# EAGLE schematic Brine_SCH_v67 (EAGLE 9.7.0)
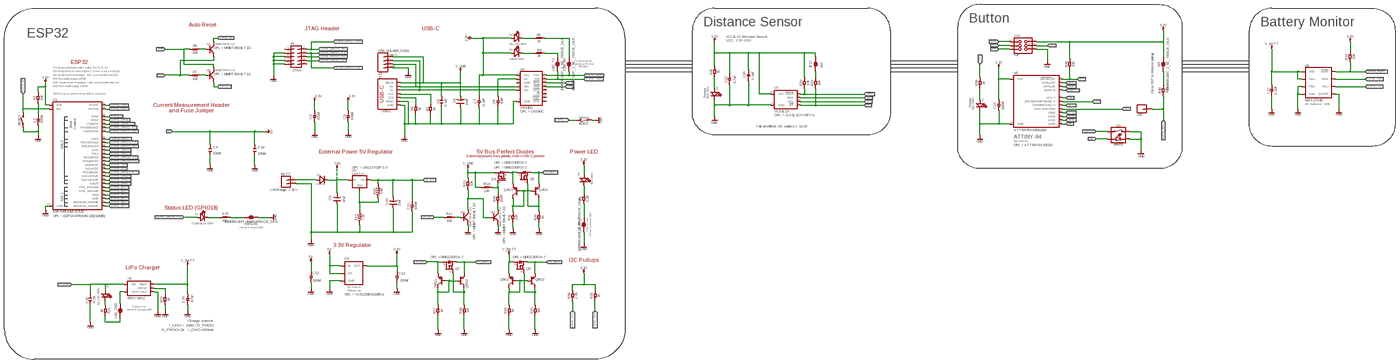
[diagram p0: schematic, sheet 1, overview]
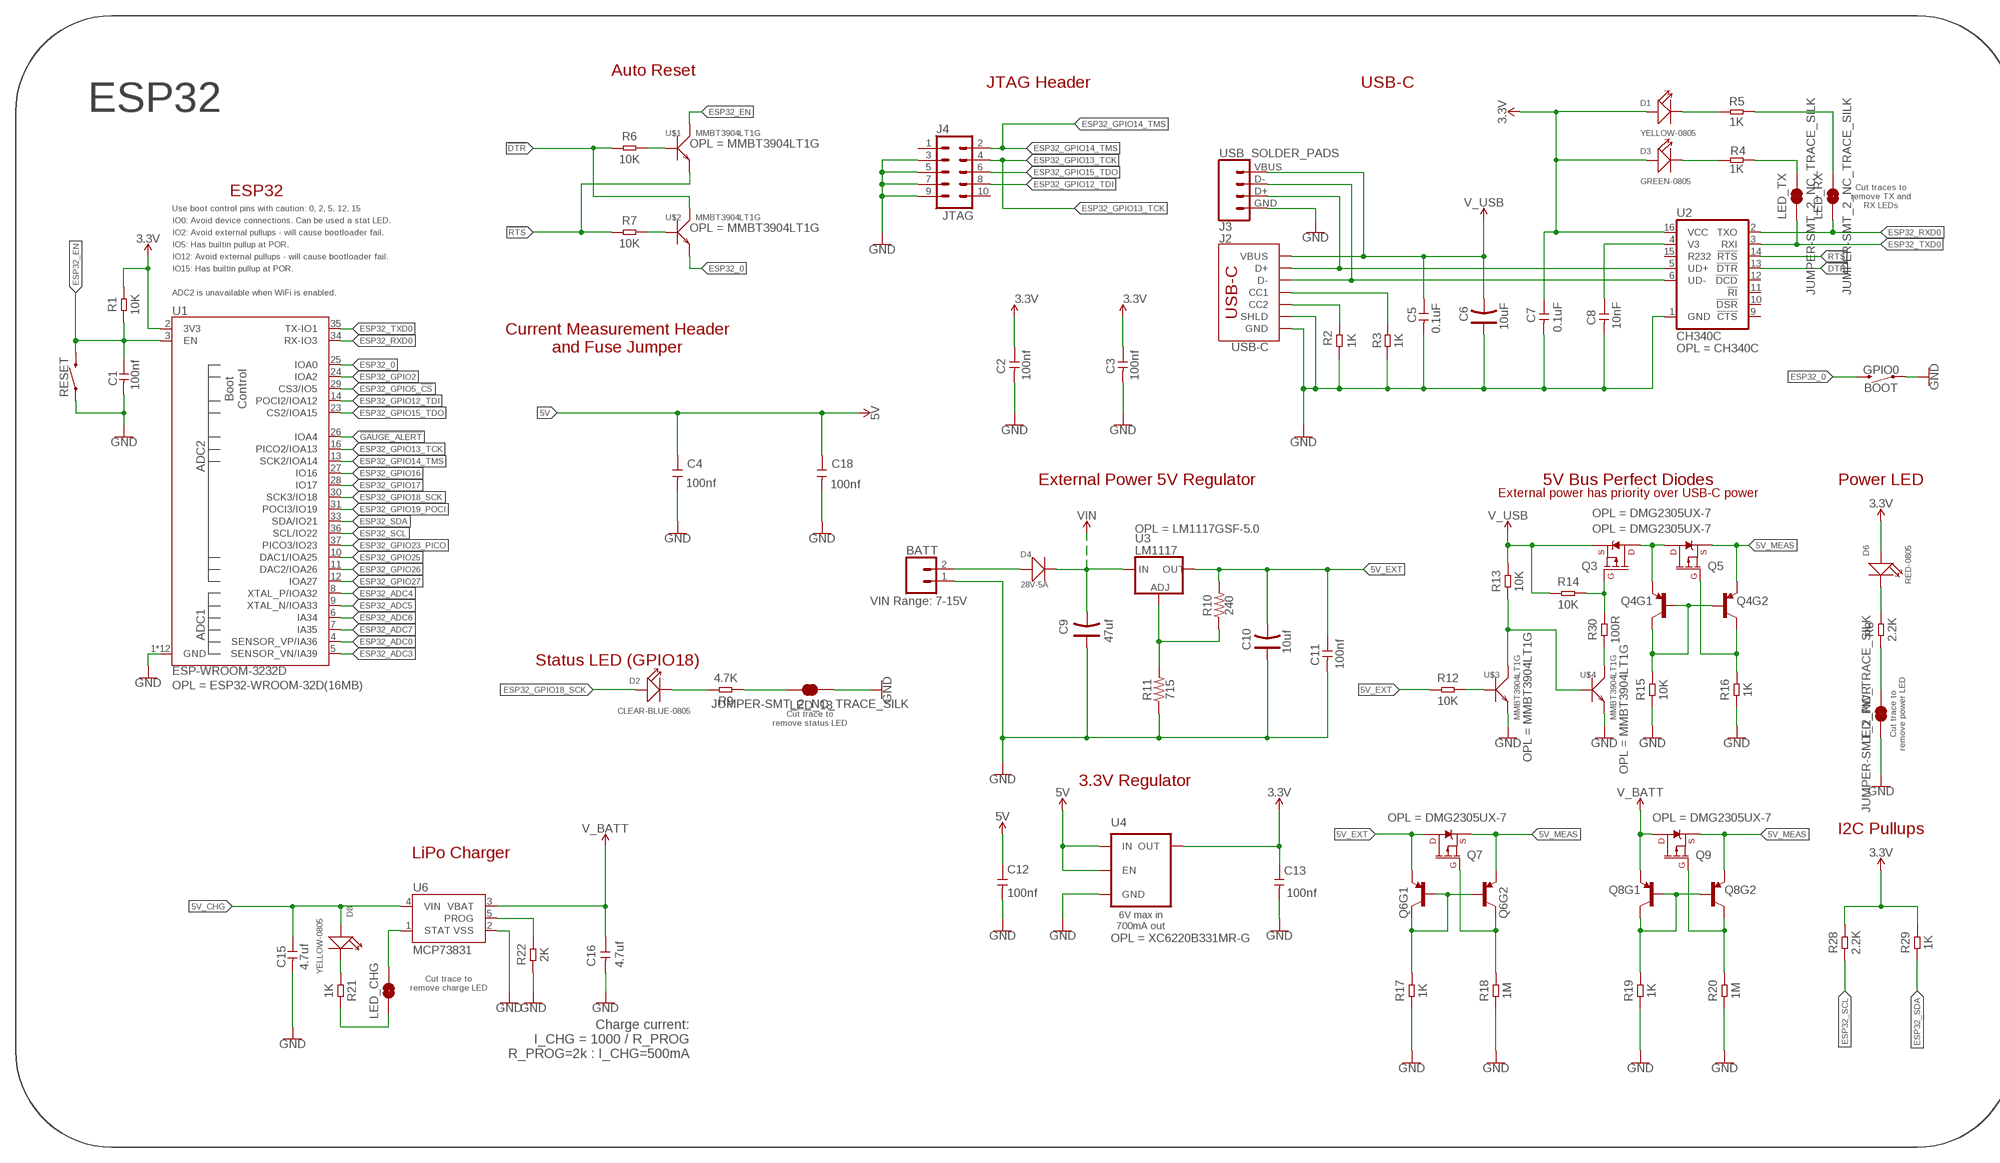
[diagram p1: schematic, sheet 1, part 1 of 4]
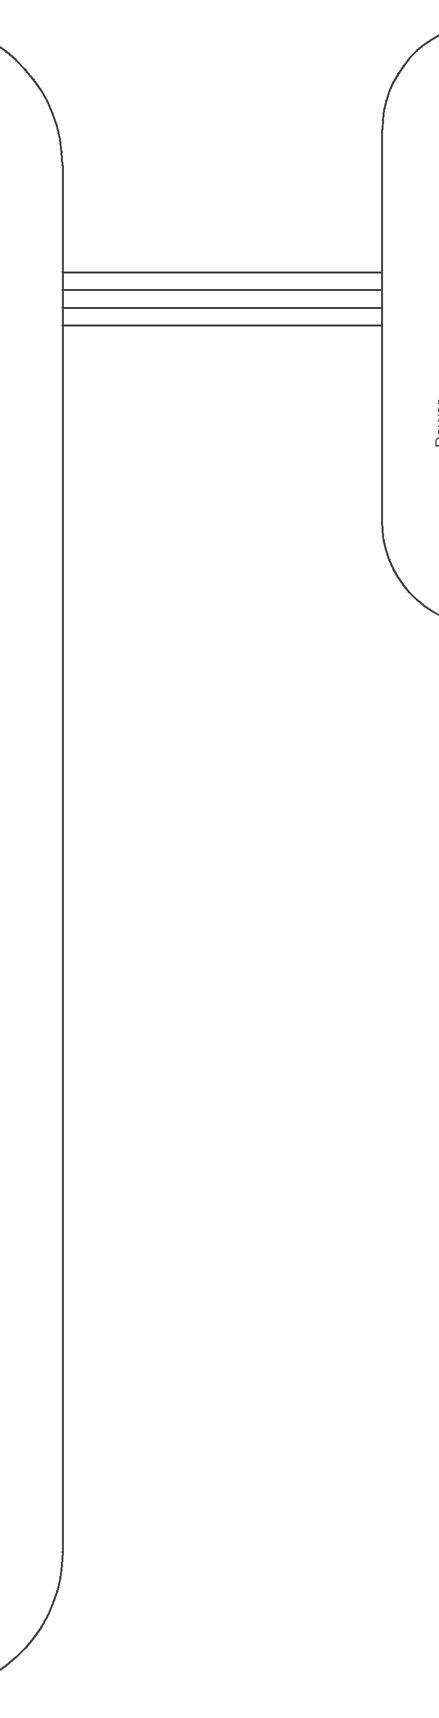
[diagram p2: schematic, sheet 1, part 2 of 4]
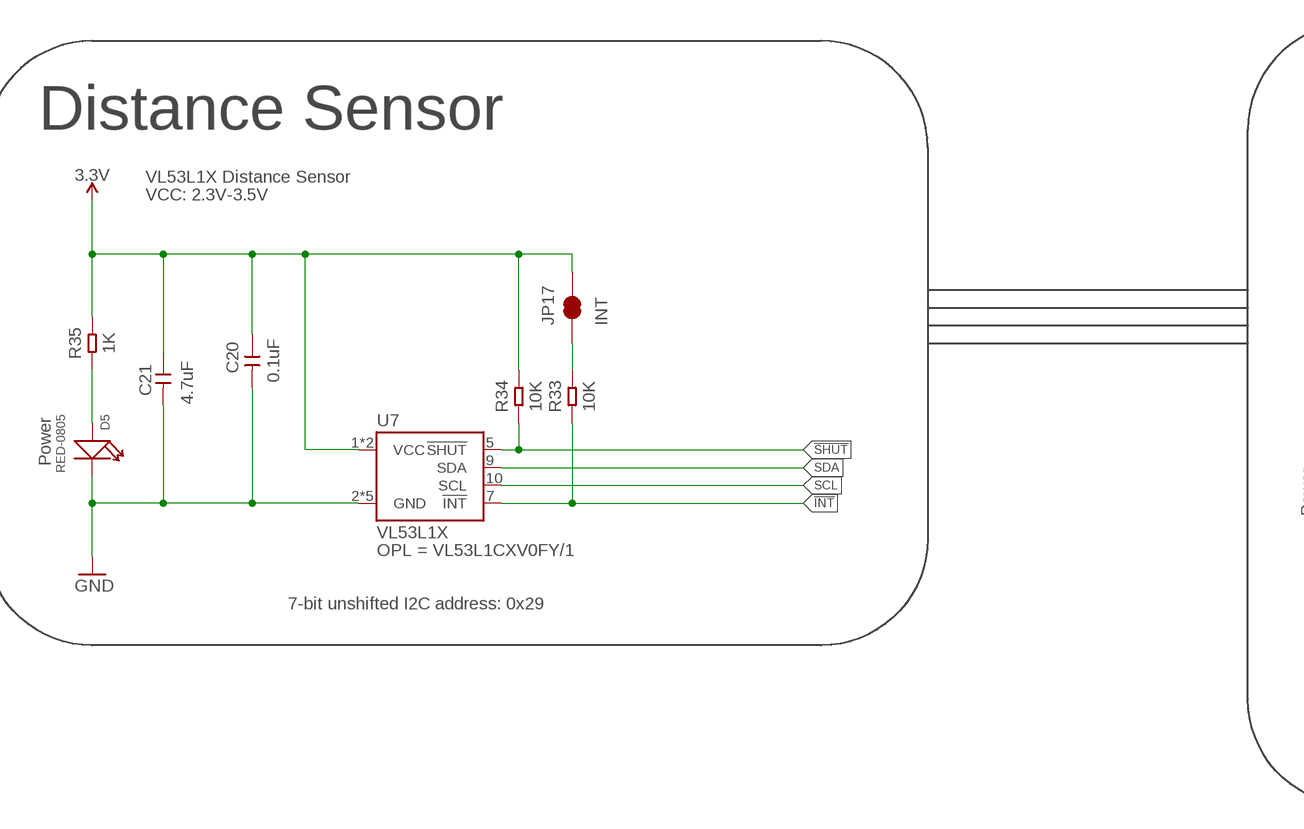
[diagram p3: schematic, sheet 1, part 3 of 4]
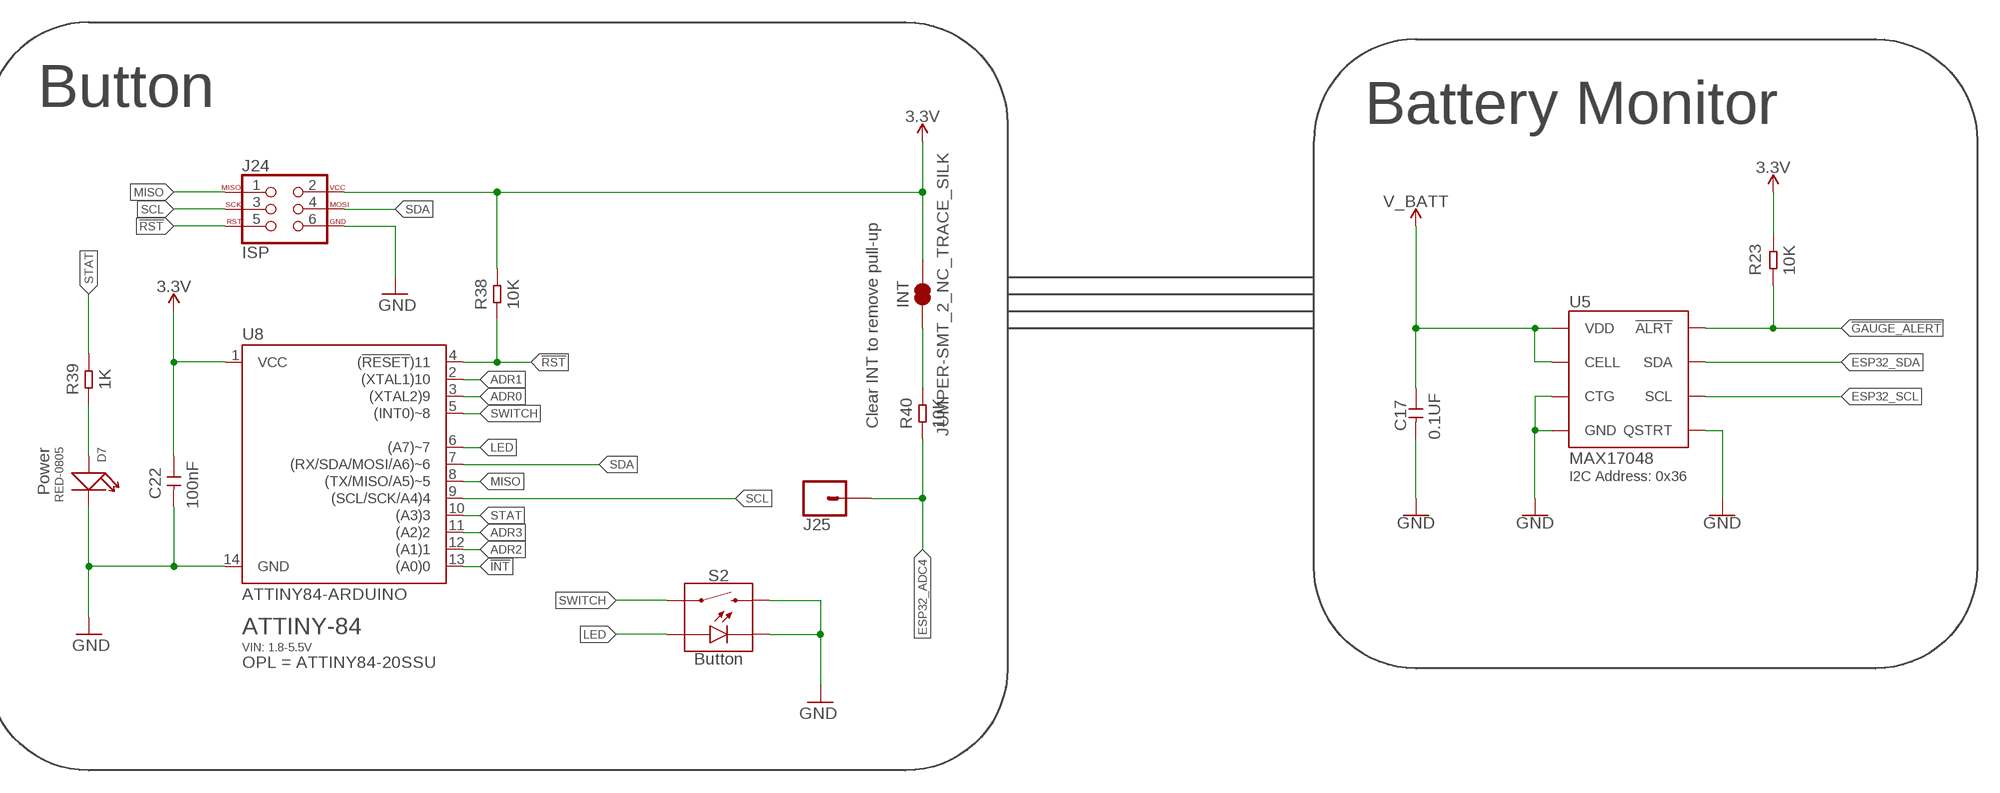
[diagram p4: schematic, sheet 1, part 4 of 4]

## Parts
BATT  CONN_02  [1X02]
BOOT  GPIO0  MOMENTARY-SWITCH-SPST-SMD-5.2-TALL-REDUNDANT  [TACTILE_SWITCH_SMD_5.2MM]
C1  100nf  CERAMIC-100NF-50V-10%-X7R(0805)  [C0805]
C2  100nf  CERAMIC-100NF-50V-10%-X7R(0805)  [C0805]
C3  100nf  CERAMIC-100NF-50V-10%-X7R(0805)  [C0805]
C4  100nf  CERAMIC-100NF-50V-10%-X7R(0805)  [C0805]
C5  0.1uF  CERAMIC-100NF-50V-10%-X7R(0805)  [C0805]
C6  10uF  TANTALUM-SMD-10UF-10V-10%(AVX-A)  [AVX-A]
C7  0.1uF  CERAMIC-100NF-50V-10%-X7R(0805)  [C0805]
C8  10nF  CERAMIC-10NF-50V-5%-X7R(0805)  [C0805]
C9  47uf  TANTALUM-SMD-47UF-6.3V(AVX-A)  [AVX-A]
C10  10uf  TANTALUM-SMD-10UF-16V-10%(AVX-A)  [AVX-A]
C11  100nf  CERAMIC-100NF-50V-10%-X7R(0805)  [C0805]
C12  100nf  CERAMIC-100NF-50V-10%-X7R(0805)  [C0805]
C13  100nf  CERAMIC-100NF-50V-10%-X7R(0805)  [C0805]
C15  4.7uf  CERAMIC-4.7UF-25V-10%-X5R(0805)  [C0805]
C16  4.7uf  CERAMIC-4.7UF-25V-10%-X5R(0805)  [C0805]
C17  0.1UF  CERAMIC-100NF-50V-10%-X7R(0805)  [C0805]
C18  100nf  CERAMIC-100NF-50V-10%-X7R(0805)  [C0805]
C20  0.1uF  CERAMIC-100NF-50V-10%-X7R(0805)  [C0805]
C21  4.7uF  CERAMIC-4.7UF-25V-10%-X5R(0805)  [C0805]
C22  100nF  CERAMIC-100NF-50V-10%-X7R(0805)  [C0805]
D1  YELLOW-0805  SMD-LED-CLEAR-YELLOW(0805)  [LED-0805]
D2  CLEAR-BLUE-0805  SMD-LED-CLEAR-BLUE(0805)  [LED-0805]
D3  GREEN-0805  SMD-LED-CLEAR-GREEN(0805)  [LED-0805]
D4  28V-5A  SMD-DIODE-SCHOTTKY-28V-5A(DO-214AA)  [DO-214AA]
D5  RED-0805  SMD-LED-CLEAR-RED(0805)  [LED-0805]
D6  RED-0805  SMD-LED-CLEAR-RED(0805)  [LED-0805]
D7  RED-0805  SMD-LED-CLEAR-RED(0805)  [LED-0805]
D8  YELLOW-0805  SMD-LED-CLEAR-YELLOW(0805)  [LED-0805]
INT  JUMPER-SMT_2_NC_TRACE_SILK  [SMT-JUMPER_2_NC_TRACE_SILK]
J2  USB-C  USB_C_4-LAYER-ISOLATED  [USB-C-16P-4LAYER-ISOLATED]
J3  USB_SOLDER_PADS  [USB-SOLDER-PADS]
J4  CONN_05X20.05_IN_PTH_SILK  [2X5_PTH_SILK_.05]
J24  ISP  AVR_SPI_PROG_3X2TESTPOINTS  [2X3_TEST_POINTS]
J25  CONN_01PTH_NO_SILK_YES_STOP  [1X01_NO_SILK]
JP17  INT  JUMPER-PAD-2-NC_BY_TRACE  [PAD-JUMPER-2-NC_BY_TRACE_YES_SILK]
LED_18  JUMPER-SMT_2_NC_TRACE_SILK  [SMT-JUMPER_2_NC_TRACE_SILK]
LED_CHG  JUMPER-SMT_2_NC_TRACE_SILK  [SMT-JUMPER_2_NC_TRACE_SILK]
LED_PWR  JUMPER-SMT_2_NC_TRACE_SILK  [SMT-JUMPER_2_NC_TRACE_SILK]
LED_RX  JUMPER-SMT_2_NC_TRACE_SILK  [SMT-JUMPER_2_NC_TRACE_SILK]
LED_TX  JUMPER-SMT_2_NC_TRACE_SILK  [SMT-JUMPER_2_NC_TRACE_SILK]
Q3  20V/4.2A/52mΩ/1.4W  MOSFET_PCH-DMG2305UX-7  [SOT23-3]
Q4  TRANS_PNP_DUALSOT-363  [SOT363_PHILIPS]
Q5  20V/4.2A/52mΩ/1.4W  MOSFET_PCH-DMG2305UX-7  [SOT23-3]
Q6  TRANS_PNP_DUALSOT-363  [SOT363_PHILIPS]
Q7  20V/4.2A/52mΩ/1.4W  MOSFET_PCH-DMG2305UX-7  [SOT23-3]
Q8  TRANS_PNP_DUALSOT-363  [SOT363_PHILIPS]
Q9  20V/4.2A/52mΩ/1.4W  MOSFET_PCH-DMG2305UX-7  [SOT23-3]
R1  10K  SMD-RES-10K-1%-1/8W(0805)  [R0805]
R2  1K  SMD-RES-5.1K-1%-1/8W(0805)  [R0805]
R3  1K  SMD-RES-5.1K-1%-1/8W(0805)  [R0805]
R4  1K  SMD-RES-1K-5%-1/8W(0805)  [R0805]
R5  1K  SMD-RES-1K-5%-1/8W(0805)  [R0805]
R6  10K  SMD-RES-10K-1%-1/8W(0805)  [R0805]
R7  10K  SMD-RES-10K-1%-1/8W(0805)  [R0805]
R8  2.2K  SMD-RES-2.2K-5%-1/8W(0805)  [R0805]
R9  4.7K  SMD-RES-4.7K-5%-1/8W(0805)  [R0805]
R10  240  R-US_CHIP-0805(2012-METRIC)  [RESC2012X65]
R11  715  R-US_CHIP-0805(2012-METRIC)  [RESC2012X65]
R12  10K  SMD-RES-10K-1%-1/8W(0805)  [R0805]
R13  10K  SMD-RES-10K-1%-1/8W(0805)  [R0805]
R14  10K  SMD-RES-10K-1%-1/8W(0805)  [R0805]
R15  10K  SMD-RES-10K-1%-1/8W(0805)  [R0805]
R16  1K  SMD-RES-4.7K-1%-1/8W(0805)  [R0805]
R17  1K  SMD-RES-100K-1%-1/8W(0805)  [R0805]
R18  1M  SMD-RES-1M-1%-1/10W(0603)  [R0603]
R19  1K  SMD-RES-100K-1%-1/8W(0805)  [R0805]
R20  1M  SMD-RES-1M-1%-1/10W(0603)  [R0603]
R21  1K  SMD-RES-1K-1%-1/8W(0805)  [R0805]
R22  2K  SMD-RES-2K-1%-1/8W(0805)  [R0805]
R23  10K  SMD-RES-10K-1%-1/8W(0805)  [R0805]
R28  2.2K  SMD-RES-2.2K-5%-1/8W(0805)  [R0805]
R29  1K  SMD-RES-2.2K-1%-1/8W(0805)  [R0805]
R30  100R  SMD-RES-100R-5%-1/8W(0805)  [R0805]
R33  10K  SMD-RES-10K-1%-1/8W(0805)  [R0805]
R34  10K  SMD-RES-10K-1%-1/8W(0805)  [R0805]
R35  1K  SMD-RES-1K-5%-1/8W(0805)  [R0805]
R38  10K  SMD-RES-10K-1%-1/8W(0805)  [R0805]
R39  1K  SMD-RES-1K-5%-1/8W(0805)  [R0805]
R40  10K  SMD-RES-10K-1%-1/8W(0805)  [R0805]
RESET  Reset  MOMENTARY-SWITCH-SPST-SMD-5.2-TALL-REDUNDANT  [TACTILE_SWITCH_SMD_5.2MM]
S2  Button  MOMENTARY-SWITCH-SPST-LED-PTH-12MM  [TACTILE_SWITCH_LED_PTH_12MM]
U1  ESP-WROOM-3232D  [ESP-WROOM-32D]
U2  CH340C  [SO016]
U3  LM1117  V_REG_LM1117SOT223  [SOT223]
U4  XC6222B331MR-G  [SOT23-5]
U5  MAX17048  MAX17048DFN8  [DFN-8]
U6  MCP73831  [SOT23-5]
U7  VL53L1X  VL53L1XSMD  [VL53L1X]
U8  ATTINY84-ARDUINO  [SO14]
U$1  MMBT3904LT1G  SMD-TRANSISTORS-NPN-40V-200MA-MMBT3904LT1G(SOT-23)  [SOT-23]
U$2  MMBT3904LT1G  SMD-TRANSISTORS-NPN-40V-200MA-MMBT3904LT1G(SOT-23)  [SOT-23]
U$3  MMBT3904LT1G  SMD-TRANSISTORS-NPN-40V-200MA-MMBT3904LT1G(SOT-23)  [SOT-23]
U$4  MMBT3904LT1G  SMD-TRANSISTORS-NPN-40V-200MA-MMBT3904LT1G(SOT-23)  [SOT-23]

## Nets
3.3V: C2.1 C3.1 C7.1 C13.1 C20.1 C21.1 C22.1 D1.+ D3.+ D6.+ INT.2 J24.2 JP17.2 R1.2 R23.2 R28.2 R29.2 R34.2 R35.2 R38.2 U1.2(3V3) U2.16(VCC) U4.5(OUT) U7.1(VCC) U7.11(VCC) U8.1(VCC)
5V [power]: C4.1 C12.1 C18.1 U4.1(IN) U4.3(EN)
5V_CHG: C15.1 D8.+ U6.4(VIN)
5V_EXT [power]: C10.- C11.1 Q6.1(E) Q7.3(D) R10.2 R12.1 U3.2(OUT) U3.4(OUT)
5V_MEAS: Q4.4(E) Q5.2(S) Q6.4(E) Q7.2(S) Q8.4(E) Q9.2(S)
!DTR!: R6.1 U2.13(!DTR) U$2.3(C)
!GAUGE_ALERT: U1.26(IOA4)
!GAUGE_ALERT!: R23.1 U5.5(!ALRT)
!INT: R33.1 U7.7(!INT) U8.13((A0)0)
!RST: J24.5 R38.1 U8.4((!RESET!)11)
!RTS!: R7.1 U2.14(!RTS) U$1.2(E)
!SHUT: R34.1 U7.5(!SHUT)
ADR0: U8.3((XTAL2)9)
ADR1: U8.2((XTAL1)10)
ADR2: U8.12((A1)1)
ADR3: U8.11((A2)2)
CC1: J2.A5(CC1) R3.2
CC2: J2.B5(CC2) R2.2
D+: J2.A6(D+) J2.B6(D+) J3.D+ U2.5(UD+)
D-: J2.A7(D-) J2.B7(D-) J3.D- U2.6(UD-)
ESP32_0: BOOT.3 BOOT.4 U1.25(IOA0) U$2.2(E)
ESP32_ADC0: U1.4(SENSOR_VP/IA36)
ESP32_ADC3: U1.5(SENSOR_VN/IA39)
ESP32_ADC4: J25.1 R40.1 U1.8(XTAL_P/IOA32)
ESP32_ADC5: U1.9(XTAL_N/IOA33)
ESP32_ADC6: U1.6(IA34)
ESP32_ADC7: U1.7(IA35)
ESP32_EN: C1.1 R1.1 RESET.3 RESET.4 U1.3(EN) U$1.3(C)
ESP32_GPIO2: U1.24(IOA2)
ESP32_GPIO5_!CS!: U1.29(CS3/IO5)
ESP32_GPIO12_TDI: J4.8 U1.14(POCI2/IOA12)
ESP32_GPIO13_TCK: J4.4 U1.16(PICO2/IOA13)
ESP32_GPIO14_TMS: J4.2 U1.13(SCK2/IOA14)
ESP32_GPIO15_TDO: J4.6 U1.23(CS2/IOA15)
ESP32_GPIO16: U1.27(IO16)
ESP32_GPIO17: U1.28(IO17)
ESP32_GPIO18_SCK: D2.+ U1.30(SCK3/IO18)
ESP32_GPIO19_POCI: U1.31(POCI3/IO19)
ESP32_GPIO23_PICO: U1.37(PICO3/IO23)
ESP32_GPIO25: U1.10(DAC1/IOA25)
ESP32_GPIO26: U1.11(DAC2/IOA26)
ESP32_GPIO27: U1.12(IOA27)
ESP32_RXD0: LED_RX.1 U1.34(RX-IO3) U2.2(TXO)
ESP32_SCL: R28.1 U1.36(SCL/IO22) U5.7(SCL)
ESP32_SDA: R29.1 U1.33(SDA/IO21) U5.8(SDA)
ESP32_TXD0: LED_TX.1 U1.35(TX-IO1) U2.3(RXI)
GND: BATT.1 BOOT.1 BOOT.2 C1.2 C2.2 C3.2 C4.2 C5.2 C6.+ C7.2 C8.2 C9.+ C10.+ C11.2 C12.2 C13.2 C15.2 C16.2 C17.2 C18.2 C20.2 C21.2 C22.2 D5.- D7.- J2.GND J2.GND2(GND) J2.SHLD1(SHLD) J2.SHLD2(SHLD) J2.SHLD3(SHLD) J2.SHLD4(SHLD) J2.SHLD5(SHLD) J2.SHLD6(SHLD) J2.SHLD7(SHLD) J2.SHLD8(SHLD) J3.GND J4.3 J4.5 J4.7 J4.9 J24.6 LED_18.2 LED_PWR.2 R2.1 R3.1 R11.1 R15.1 R16.1 R17.1 R18.1 R19.1 R20.1 R22.1 RESET.1 RESET.2 S2.2 S2.C U1.1(GND) U1.15(GND) U1.38(GND) U1.GND U1.GNDT1(GND) U1.GNDT2(GND) U1.GNDT3(GND) U1.GNDT4(GND) U1.GNDT5(GND) U1.GNDT6(GND) U1.GNDT7(GND) U1.GNDT8(GND) U2.1(GND) U4.2(GND) U5.1(CTG) U5.4(GND) U5.6(QSTRT) U5.9(GND) U6.2(VSS) U7.2(GND) U7.3(GND) U7.4(GND) U7.6(GND) U7.12(GND) U8.14(GND) U$3.2(E) U$4.2(E)
INT_R: INT.1 R40.2
LED: S2.A U8.6((A7)~7)
MISO: J24.1 U8.8((TX/MISO/A5)~5)
N$1: BATT.2 D4.+
N$2: D6.- R8.2
N$3: D2.- R9.2
N$4: LED_18.1 R9.1
N$5: D3.- R4.2
N$6: C8.1 U2.4(V3)
N$7: D1.- R5.2
N$8: Q6.2(B) Q6.5(B) Q6.6(C) R17.2
N$9: Q3.1(G) R14.2 R30.2
N$10: Q6.3(C) Q7.1(G) R18.2
N$11: R30.1 U$4.3(C)
N$12: Q4.2(B) Q4.5(B) Q4.6(C) R15.2
N$13: Q8.2(B) Q8.5(B) Q8.6(C) R19.2
N$14: LED_PWR.1 R8.1
N$15: R10.1 R11.2 U3.1(ADJ)
N$16: Q4.3(C) Q5.1(G) R16.2
N$17: Q8.3(C) Q9.1(G) R20.2
N$18: R6.2 U$1.1(B)
N$19: R12.2 U$3.1(B)
N$20: R7.2 U$2.1(B)
N$21: R22.2 U6.5(PROG)
N$22: R13.1 U$3.3(C) U$4.1(B)
N$23: D5.+ R35.1
N$24: LED_CHG.2 U6.1(STAT)
N$25: LED_CHG.1 R21.2
N$26: D8.- R21.1
N$30: LED_TX.2 R4.1
N$31: LED_RX.2 R5.1
N$38: JP17.1 R33.2
N$40: D7.+ R39.1
SCL: J24.3 U7.10(SCL) U8.9((SCL/SCK/A4)4)
SDA: J24.4 U7.9(SDA) U8.7((RX/SDA/MOSI/A6)~6)
STAT: R39.2 U8.10((A3)3)
SWITCH: S2.4 U8.5((INT0)~8)
V_BATT: C16.1 C17.1 Q8.1(E) Q9.3(D) U5.2(CELL) U5.3(VDD) U6.3(VBAT)
V_USB: C5.1 C6.- J2.VBUS1(VBUS) J2.VBUS2(VBUS) J3.VBUS Q3.2(S) R13.2 R14.1
VIN [power]: C9.- D4.- U3.3(IN)
VUSB_PROT: Q3.3(D) Q4.1(E) Q5.3(D)
Unconnected: J4.1 J4.10 U2.9(!CTS) U2.10(!DSR) U2.11(!RI) U2.12(!DCD) U2.15(R232)

## Notes on the sheet
- Button
- Auto Reset | Distance Sensor | Battery Monitor
- JTAG Header | USB-C
- ESP32 | VL53L1X Distance Sensor
- VCC: 2.3V-3.5V
- ESP32
- Use boot control pins with caution: 0, 2, 5, 12, 15
- Cut traces to
  remove TX and
  RX LEDs
- IO0: Avoid device connections. Can be used a stat LED. | JTAG
- IO2: Avoid external pullups - will cause bootloader fail.
- IO5: Has builtin pullup at POR.
- IO12: Avoid external pullups - will cause bootloader fail.
- IO15: Has builtin pullup at POR.
- ADC2 is unavailable when WiFi is enabled. | Clear INT to remove pull-up
- Power | Power
- I2C Address: 0x36
- Current Measurement Header
  and Fuse Jumper
- 7-bit unshifted I2C address: 0x29
- ATTINY-84
- VIN: 1.8-5.5V
- Power LED
- External Power 5V Regulator | 5V Bus Perfect Diodes
- External power has priority over USB-C power
- VIN Range: 7-15V
- Status LED (GPIO18)
- Cut trace to
  remove power LED
- Cut trace to
  remove status LED
- 3.3V Regulator
- I2C Pullups
- LiPo Charger
- 6V max in
  700mA out
- Cut trace to
  remove charge LED
- Charge current:
  I_CHG = 1000 / R_PROG
  R_PROG=2k : I_CHG=500mA

## Library data of the parts
BATT = SparkFun-Connectors:CONN_02: Multi connection point. Often used as Generic Header-pin footprint for 0.1 inch spaced/style header connections On any of the 0.1 inch spaced packages, you can populate with these: Break Away Headers - Straight <https://www.sparkfun.com/products/116> (PRT-00116) Break Away Male Headers - Right Angle <https://www.sparkfun.com/products/553> (PRT-00553) Female Headers <https://www.sparkfun.com/products/115> (PRT-00115) Break Away Headers - Machine Pin <https://www.sparkfun.com/products/117> (PRT-00117) Break Away Female Headers - Swiss Machine Pin <https://www.sparkfun.com/products/743> (PRT-00743) For SCREWTERMINALS and SPRING TERMINALS visit here: Screw Terimnals on SparkFun.com <https://www.sparkfun.com/search/results?term=Screw+Terminals> (5mm/3.5mm/2.54mm spacing) This device is also useful as a general connection point to wire up your design to another part of your project. Our various solder wires solder well into these plated through hole pads. Hook-Up Wire - Assortment (Stranded, 22 AWG) <https://www.sparkfun.com/products/11375> (PRT-11375) Hook-Up Wire - Assortment (Solid Core, 22 AWG) <https://www.sparkfun.com/products/11367> (PRT-11367) View the entire wire category on our website here <https://www.sparkfun.com/categories/141> Special notes: Molex polarized connector foot print use with: PRT-08233 with associated crimp pins and housings. 2.54_SCREWTERM for use with PRT-10571. 3.5mm Screw Terminal footprints for PRT-08084 5mm Screw Terminal footprints for use with PRT-08432
BOOT RESET = SparkFun-Switches:MOMENTARY-SWITCH-SPST: Momentary Switch (Pushbutton) - SPST Normally-open (NO) SPST momentary switches (buttons, pushbuttons). Variants PTH-12MM - 12mm square, through-hole Momentary Pushbutton Switch - 12mm Square <https://www.sparkfun.com/products/9190> (COM-09190) PTH-6.0MM, PTH-6.0MM-KIT - 6.0mm square, through-hole Mini Pushbutton Switch <https://www.sparkfun.com/products/97> (COM-00097) KIT package intended for soldering kit's - only one side of pads' copper is exposed. PTH-RIGHT-ANGLE-KIT - Right-angle, through-hole Right Angle Tactile Button <https://www.sparkfun.com/products/10791> - Used on SparkFun BigTime Watch Kit <https://www.sparkfun.com/products/11734> SMD-12MM - 12mm square, surface-mount Tactile Button - SMD (12mm) <https://www.sparkfun.com/products/12993> (COM-12993) Used on SparkFun PicoBoard <https://www.sparkfun.com/products/11888> SMD-4.5MM - 4.5mm Square Trackball Switch Used on SparkFun Blackberry Trackballer Breakout <https://www.sparkfun.com/products/13169> SMD-4.6MMX2.8MM - 4.60mm x 2.80mm, surface mount Used on SparkFun Pro Micro - RP2040 <https://www.sparkfun.com/products/17717> SMD-5.2MM, SMD-5.2-REDUNDANT - 5.2mm square, surface-mount Mini Pushbutton Switch - SMD <https://www.sparkfun.com/products/8720> (COM-08720) Used on Arduino Pro Mini <https://www.sparkfun.com/products/11114> REDUNDANT package connects both switch circuits together SMD-6.0X3.5MM - 6.0 x 3.5mm, surface mount Momentary Reset Switch SMD <https://www.sparkfun.com/products/8229> (COM-08229) SMD-6.2MM-TALL - 6.2mm square, surface mount Tactile Button - SMD (6mm) <https://www.sparkfun.com/products/12992> Used on SparkFun Digital Sandbox <https://www.sparkfun.com/products/12651> SMD-RIGHT-ANGLE - Right-angle, surface mount Used on SparkFun Block for Intel® Edison - Arduino <https://www.sparkfun.com/products/13036>; PROD_ID: SWCH-14139
C1-C4 C11-C13 C18 = OPL_Capacitor:CERAMIC-100NF-50V-10%-X7R(0805): 302010165; MPN: CC0805KRX7R9BB104
C5 C7 C17 C20 C22 = OPL_Capacitor:CERAMIC-100NF-50V-10%-X7R(0805): 302010165; MPN: CC0805KRX7R9BB104; VALUE: 100nf
C6 = OPL_Capacitor:TANTALUM-SMD-10UF-10V-10%(AVX-A): 302020011; MPN: TAJA106K010RNJ; VALUE: 10uf
C8 = OPL_Capacitor:CERAMIC-10NF-50V-5%-X7R(0805): 302010175; MPN: CC0805JRX7R9BB103; VALUE: 10nf
C9 = OPL_Capacitor:TANTALUM-SMD-47UF-6.3V(AVX-A): 302020005; MPN: TAJA476*006#NJ
C10 = OPL_Capacitor:TANTALUM-SMD-10UF-16V-10%(AVX-A): 302020002; MPN: TAJA106K016RNJ
C15 C16 = OPL_Capacitor:CERAMIC-4.7UF-25V-10%-X5R(0805): 302010146; MPN: CC0805KKX5R8BB475
C21 = OPL_Capacitor:CERAMIC-4.7UF-25V-10%-X5R(0805): 302010146; MPN: CC0805KKX5R8BB475; VALUE: 4.7uf
D1 D8 = OPL_Optoelectronics:SMD-LED-CLEAR-YELLOW(0805): 304090039; MPN: 17-215UYC/S530-A3/TR8
D2 = OPL_Optoelectronics:SMD-LED-CLEAR-BLUE(0805): 304090061; MPN: EL-17-215/BHC-AN1P2/3T
D3 = OPL_Optoelectronics:SMD-LED-CLEAR-GREEN(0805): 304090057; MPN: 17-215SYGC/S530-E2/TR8
D4 = OPL_Discrete_Semiconductor:SMD-DIODE-SCHOTTKY-28V-5A(DO-214AA): 304020021; MPN: SS54B
D5-D7 = OPL_Optoelectronics:SMD-LED-CLEAR-RED(0805): 304090046; MPN: 17-215SURC/S530-A2/TR8
INT LED_18 LED_CHG LED_PWR LED_RX LED_TX = SparkFun-Jumpers:JUMPER-SMT_2_NC_TRACE: Normally closed trace jumper This jumper has a trace between two pads so it's normally closed (NC). Use a razor knife to open the connection. For best results follow the IPC guidelines for cutting traces: Cutout at least 0.063 mm (0.005 in). Remove all loose material to clean up the cut area. Seal the cut with an approved epoxy. Reapply solder to reclose the connection.
J2 = SparkFun-Connectors:USB_C: USB Type C 16Pin Connector Super Speed pins not available on the 16-pin purely SMD connector so this part is best for USB 2.0 implementations. D1 and D2 are tied together enabling D+/- no matter which way the cable is plugged into the connector. The two channel configuration pins (CC1/2) are exposed. These are normally connected to ground via 5.1k resistors but can be reconfigured for high current/high power applications. **4-LAYER BOARD WARNING!!** If designing 4-layer board, make sure to select the variant _4-LAYER-ISOLATED. The linked footprint (USB-C-16-4LAYER-ISOLATED) includes some very necessary cutout polygons in the inner layers (2 and 15). This prevents the PTH mounting shield legs on the USB connector from electrically connecting any other polygons on the inner layers (usually VCC and GND).; PROD_ID: CONN-14122; VALUE: USB Female Type C Connector
J3 = SparkFun-Connectors:USB_SOLDER_PADS: Solder pad access to USB pins. Helpful to expose on PCBs so user can attach external USB connector if necessary.
J4 = SparkFun-Connectors:CONN_05X2: Multi connection point. Often used as Generic Header-pin footprint for 0.1 inch spaced/style header connections For AVR SPI programming port, see special device with nice symbol: "AVR_SPI_PROG_5x2.dev" You can populate with any combo of single row headers, but if you'd like an exact match, check these: 2x5 AVR ICSP Male Header <https://www.sparkfun.com/products/778> (PRT-00778) 2x5 Pin Shrouded Header <https://www.sparkfun.com/products/8506> (PRT-08506) On any of the 0.1 inch spaced packages, you can populate with these: Break Away Headers - Straight <https://www.sparkfun.com/products/116> (PRT-00116) Break Away Male Headers - Right Angle <https://www.sparkfun.com/products/553> (PRT-00553) Female Headers <https://www.sparkfun.com/products/115> (PRT-00115) Break Away Headers - Machine Pin <https://www.sparkfun.com/products/117> (PRT-00117) Break Away Female Headers - Swiss Machine Pin <https://www.sparkfun.com/products/743> (PRT-00743) Special note: the shrouded connector mates well with our 5x2 ribbon cables: 2x5 Pin IDC Ribbon Cable <https://www.sparkfun.com/products/8535> (PRT-08535)
J24 = SparkFun-Connectors:AVR_SPI_PROG_3X2: AVR ISP 6 Pin This is the reduced ISP connector for AVR programming. Common on Arduino. This footprint will take up less PCB space and can be used with a 10-pin to 6-pin adapter such as SKU: BOB-08508 **Special note about "TEST_POINT" package. The stop mask is on the top side, so if you want your programming test points to be on the bottom of your board, make sure to place this package on the bottom side of the board. This also ensure that the orientation to program from the bottom side will be correct. SparkFun Products: SparkFun ISP Pogo Adapter <https://www.sparkfun.com/products/11591> - NS Tiny AVR Programmer <https://www.sparkfun.com/products/11801> -PTH
J25 = SparkFun-Connectors:CONN_01: Single connection point. Often used as Generic Header-pin footprint for 0.1 inch spaced/style header connections On any of the 0.1 inch spaced packages, you can populate with these: Break Away Headers - Straight <https://www.sparkfun.com/products/116> (PRT-00116) Break Away Male Headers - Right Angle <https://www.sparkfun.com/products/553> (PRT-00553) Female Headers <https://www.sparkfun.com/products/115> (PRT-00115) Break Away Headers - Machine Pin <https://www.sparkfun.com/products/117> (PRT-00117) Break Away Female Headers - Swiss Machine Pin <https://www.sparkfun.com/products/743> (PRT-00743) This device is also useful as a general connection point to wire up your design to another part of your project. Our various solder wires solder well into these plated through hole pads. Hook-Up Wire - Assortment (Stranded, 22 AWG) <https://www.sparkfun.com/products/11375> (PRT-11375) Hook-Up Wire - Assortment (Solid Core, 22 AWG) <https://www.sparkfun.com/products/11367> (PRT-11367) View the entire wire category on our website here <https://www.sparkfun.com/categories/141> Special notes: SMTSO-256-ET is a "flush mount" nut for a 4-40 screw. We mostly use this on specialty testbeds; it is a nice way to connect hardware to your PCB at an adjustable hieght. Also note, the SNAP packages are for using a snappable style connector. We sell a baggie of snaps and they are also used on two LilyPad designs: Snap Assortment - 30 pack (male and female) <https://www.sparkfun.com/products/11347> (DEV-11347) LilyPad Arduino SimpleSnap <https://www.sparkfun.com/products/10941> (DEV-10941) LilyPad SimpleSnap Protoboard <https://www.sparkfun.com/products/10940> (DEV-10940)
JP17 = SparkFun-Passives:JUMPER-PAD-2-NC_BY_TRACE
Q3 Q5 Q7 Q9 = SparkFun-DiscreteSemi:MOSFET_PCH: P-channel MOSFETs Voltage controlled devices that allow control of high current outputs. SparkFun Products: SparkFun ESP32 Thing <https://www.sparkfun.com/products/13907> SparkFun ESP8266 Thing <https://www.sparkfun.com/products/13231> SparkFun Pi Servo HAT V2 <https://www.sparkfun.com/products/15316> DMG2305UX-7 (20V/4.2A/SOT23-3); OPL: DMG2305UX-7; PROD_ID: TRANS-14388
Q4 Q6 Q8 = SparkFun-DiscreteSemi:TRANS_PNP_DUAL: Dual PNP Transistors in Single Package The BCM857BS puts two PNP transistors in a single package. Bipolar (BJT) Transistor Array 2 PNP (Dual) 45V 100mA 100MHz 200mW Surface Mount SOT-363 Datasheet <https://www.diodes.com/assets/Datasheets/BCM857BS.pdf> SparkFun Products: SparkFun Pi Servo HAT V2 <https://www.sparkfun.com>; PROD_ID: TRANS-14386
R1 R6 R7 R12-R15 R23 R33 R34 R38 R40 = OPL_Resistor:SMD-RES-10K-1%-1/8W(0805): 301012152; MPN: RC0805FR-0710KL
R2 R3 = OPL_Resistor:SMD-RES-5.1K-1%-1/8W(0805): 301012180; MPN: RC0805JR-071KL
R4 R5 R35 R39 = OPL_Resistor:SMD-RES-1K-5%-1/8W(0805): 301012189; MPN: RC0805JR-071KL
R8 R28 = OPL_Resistor:SMD-RES-2.2K-5%-1/8W(0805): 301012193; MPN: RC0805JR-072K2L
R9 = OPL_Resistor:SMD-RES-4.7K-5%-1/8W(0805): 301010306; MPN: RC0805JR-074K7L
R10 R11 = Tutorial - Fusion 360:R-US: Resistor Fixed - ANSI; CATEGORY: Resistor; SUB-CATEGORY: Fixed
R16 = OPL_Resistor:SMD-RES-4.7K-1%-1/8W(0805): 301012175; MPN: RC0805JR-071KL
R17 R19 = OPL_Resistor:SMD-RES-100K-1%-1/8W(0805): 301012150; MPN: RC0805JR-071KL
R18 R20 = OPL_Resistor:SMD-RES-1M-1%-1/10W(0603): 301012044; MPN: RC0603FR-071ML
R21 = OPL_Resistor:SMD-RES-1K-1%-1/8W(0805): 301012157; MPN: RC0805JR-071KL
R22 = OPL_Resistor:SMD-RES-2K-1%-1/8W(0805): 301012164; MPN: RC0805JR-071KL; VALUE: 1K
R29 = OPL_Resistor:SMD-RES-2.2K-1%-1/8W(0805): 301012163; MPN: RC0805JR-071KL
R30 = OPL_Resistor:SMD-RES-100R-5%-1/8W(0805): 301010319; MPN: RC0805JR-07100RL
S2 = SparkFun-Switches:MOMENTARY-SWITCH-SPST-LED: Momentary Switch (Pushbutton) - SPST - w/ LED Normally-open (NO) SPST momentary switches (buttons, pushbuttons), with a built-in LED. Variants PTH-CHERRY - Cherry MX Switch Cherry MX Keyswitches are top-of-the-line mechanical keyboard switches. They’re satisfyingly “clicky”, reliable up to tens-of-millions of key presses, and a standard in gaming and programming keyboards across the globe. This ‘blue’ version Cherry MX Switch is favored by most due to its secondary internal actuator making it less likely to “double-tap.” If you are looking for a noticeably audible and high-quality key switch, this is the perfect option for you! Cherry MX Switch <https://www.sparkfun.com/products/13834> (COM-13834) Cherry MX Switch Breakout <https://www.sparkfun.com/products/13773> (BOB-13773) PTH-12MM and PTH-12MM-KIT - 12mm Illuminated LED KIT variant is for soldering kits. There is no tStop (covering up the top side of the pads with mask). This helps the beginner see which side they should be soldering too. LED Tactile Button Breakout <https://www.sparkfun.com/products/10467> (BOB-10467) LED Tactile Button - Red <https://www.sparkfun.com/products/10442> (COM-10442) LED Tactile Button - Blue <https://www.sparkfun.com/products/10443> (COM-10443) LED Tactile Button - Green <https://www.sparkfun.com/products/10440> (COM-10440) LED Tactile Button - Orange <https://www.sparkfun.com/products/10441> (COM-10441) LED Tactile Button - White <https://www.sparkfun.com/products/10439> (COM-10439); PROD_ID: SWCH-11758; SF_SKU: COM-10442
U1 = SparkFun-RF:ESP-WROOM-32: ESP-WROOM-32D - trace antenna (includes keepout) ESP-WROOM-32U - U.FL antenna connector Includes both "standard" footprints and "narrow" version (for use with tighter layouts).; OPL: ESP32-WROOM-32D(16MB); PROD_ID: IC-15676
U2 = SparkFun-IC-Comms:CH340C; OPL: CH340C; PROD_ID: IC-14038
U3 = SparkFun-IC-Power:V_REG_LM1117: Voltage Regulator LM1117 Standard adjustable voltage regulator but in SMD form. Spark Fun Electronics SKU : COM-00595; OPL: LM1117GSF-5.0; PROD_ID: VREG-08170
U4 = SparkFun-IC-Power:XC6222; IOUT: 700mA; OPL: XC6220B331MR-G; PROD_ID: VREG-16775; VOUT: 3.3V
U5 = SparkFun-IC-Power:MAX17048: Micropower 1-Cell Li+ ModelGauge SparkFun Products Qduino Mini <https://www.sparkfun.com/products/13614> (DEV-13614); PROD_ID: IC-12551
U6 = SparkFun-IC-Power:MCP73831: MCP73831T Li-Ion, Li-Pol Controller Miniature single cell, fully integrated Li-Ion, Li-polymer charge management controller Datasheet <http://ww1.microchip.com/downloads/en/DeviceDoc/20001984g.pdf> SparkFun Products: SparkFun ESP32 Thing <https://www.sparkfun.com/products/13907> SparkFun 9DoF Razor IMU M0 <https://www.sparkfun.com/products/14001>; PROD_ID: IC-09995
U7 = SparkFun-Sensors:VL53L1X: STMicroelectronics VL53L1X - 400 cm IR Laser ToF Sensor VL53L1X is a state-of-the-art ToF laser-ranging sensor, enhancing the ST FlightSense product family. It is the fastest miniature ToF sensor currently on the market with accurate ranging up to 4 m and fast ranging frequency (up to 50 Hz). Housed in a miniature and reflowable package, it integrates a single photon avalanche diode (SPAD) receiving array, a 940 nm invisible laser Class 1 emitter, physical infrared filters, and optics to achieve the best ranging performance in various ambient lighting conditions with a range of cover window options.; OPL: VL53L1CXV0FY/1; PROD_ID: IC-13960
U8 = SparkFun-IC-Microcontroller:ATTINY84-ARDUINO; OPL: ATTINY84-20SSU; PROD_ID: IC-14155
U$1-U$4 = OPL_Discrete_Semiconductor:SMD-TRANSISTORS-NPN-40V-200MA-MMBT3904LT1G(SOT-23): 305010013; MPN: MMBT3904LT1G; OPL: MMBT3904LT1G